# Altium schematic sheet photoresistance_measure.SchDoc
size A4
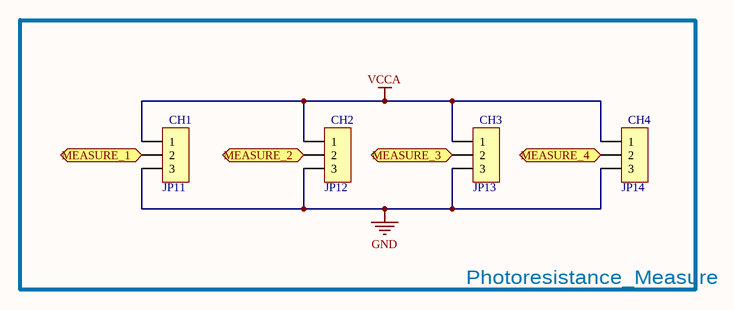
[diagram p0: photoresistance_measure.SchDoc]

## Parts
JP11  CH1  [HDR2.54-LI-3P]
JP12  CH2  [HDR2.54-LI-3P]
JP13  CH3  [HDR2.54-LI-3P]
JP14  CH4  [HDR2.54-LI-3P]

## Blocks framed on the sheet
Photoresistance_Measure: JP11-JP14

## Ports
MEASURE_1 (bidir), MEASURE_2 (bidir), MEASURE_3 (bidir), MEASURE_4 (bidir)

## Nets
GND: JP11.3 JP12.3 JP13.3 JP14.3
VCCA: JP11.1 JP12.1 JP13.1 JP14.1
MEASURE_1: JP11.2 ; port MEASURE_1
MEASURE_2: JP12.2 ; port MEASURE_2
MEASURE_3: JP13.2 ; port MEASURE_3
MEASURE_4: JP14.2 ; port MEASURE_4

## Library data of the parts
JP11-JP14 = Header 3: 3P接插件; 版权归属: 源创客; BOM名称: 3P接插件; 学习资源: www.ooocke.com